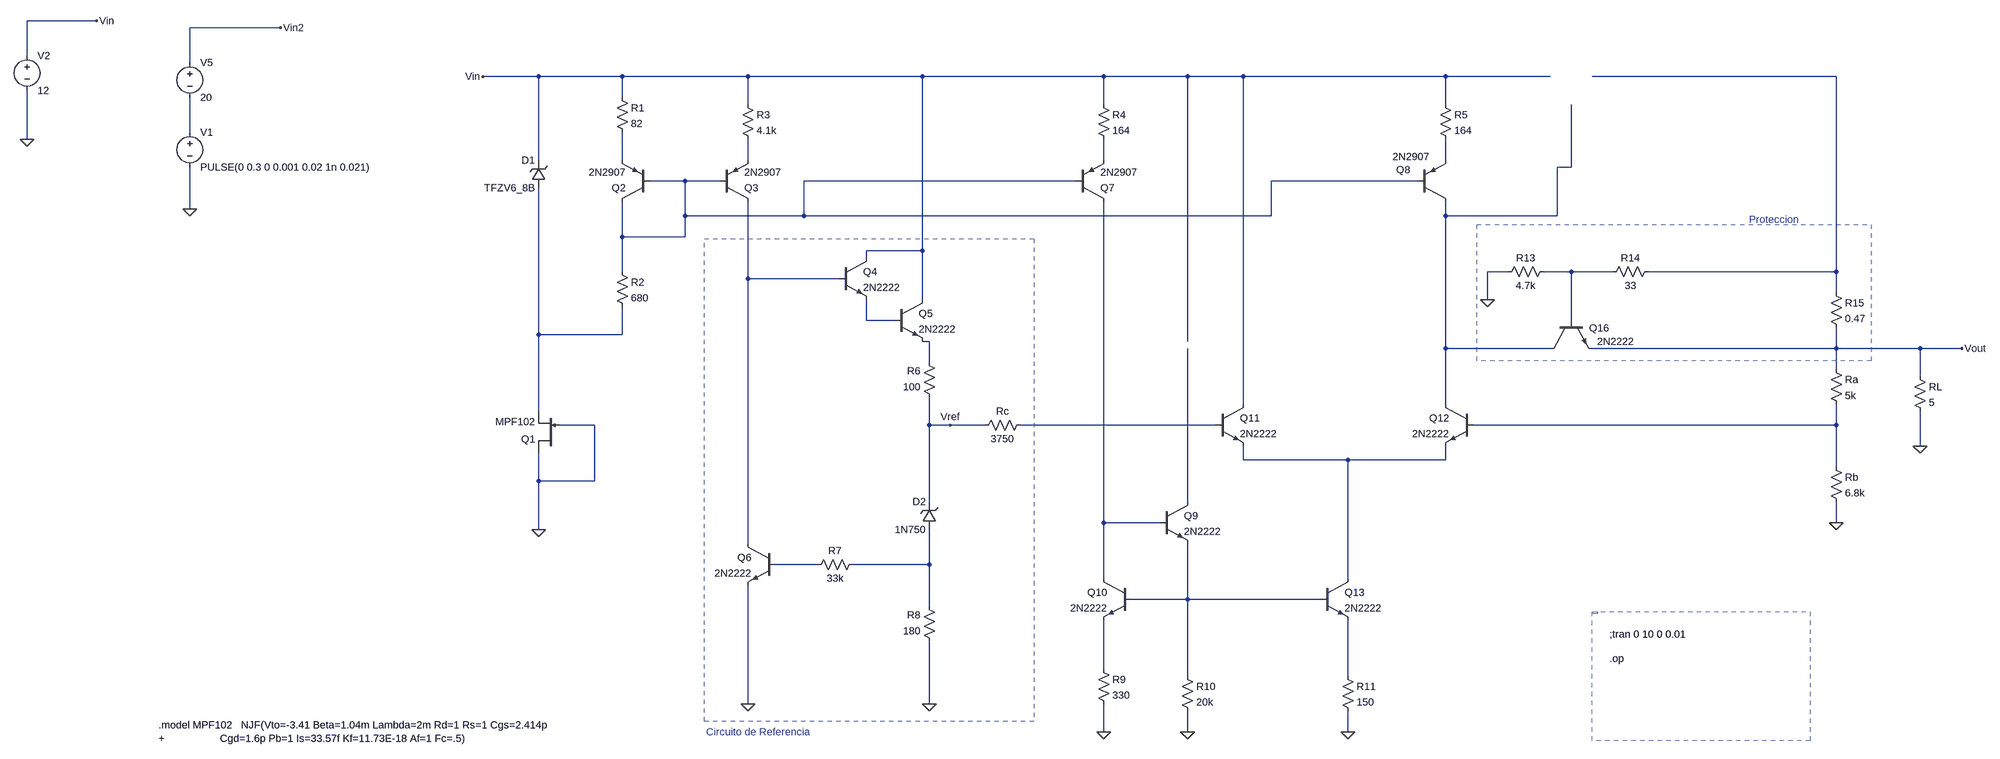
[diagram p0: schematic Test.asc]
Test.asc, the LTspice schematic file:
Version 4
SHEET 1 2264 1600
WIRE -3184 -240 -3392 -240
WIRE -2704 -224 -2912 -224
WIRE -3392 -160 -3392 -240
WIRE -2912 -144 -2912 -224
WIRE -2112 -112 -2240 -112
WIRE -1920 -112 -2112 -112
WIRE -1632 -112 -1920 -112
WIRE -1232 -112 -1632 -112
WIRE -816 -112 -1232 -112
WIRE -624 -112 -816 -112
WIRE -496 -112 -624 -112
WIRE -32 -112 -496 -112
WIRE 208 -112 -32 -112
WIRE 864 -112 304 -112
WIRE -1920 -64 -1920 -112
WIRE -1632 -48 -1632 -112
WIRE -816 -48 -816 -112
WIRE -32 -48 -32 -112
WIRE -2912 16 -2912 -64
WIRE -3392 32 -3392 -80
WIRE -2112 80 -2112 -112
WIRE -1920 80 -1920 16
WIRE -1632 80 -1632 32
WIRE -816 80 -816 32
WIRE -32 80 -32 32
WIRE 256 96 256 -48
WIRE 256 96 224 96
WIRE -1776 128 -1856 128
WIRE -1696 128 -1776 128
WIRE -880 128 -1504 128
WIRE -96 128 -432 128
WIRE -2912 192 -2912 96
WIRE -1776 208 -1776 128
WIRE -1504 208 -1504 128
WIRE -1504 208 -1776 208
WIRE -432 208 -432 128
WIRE -432 208 -1504 208
WIRE -32 208 -32 176
WIRE 224 208 224 96
WIRE 224 208 -32 208
WIRE -1920 256 -1920 176
WIRE -1776 256 -1776 208
WIRE -1776 256 -1920 256
WIRE -1232 288 -1232 -112
WIRE -1232 288 -1360 288
WIRE -1360 304 -1360 288
WIRE -1920 336 -1920 256
WIRE 112 336 64 336
WIRE 256 336 192 336
WIRE 352 336 256 336
WIRE 864 336 864 -112
WIRE 864 336 432 336
WIRE -1632 352 -1632 176
WIRE -1424 352 -1632 352
WIRE 864 384 864 336
WIRE -1232 400 -1232 288
WIRE 64 400 64 336
WIRE -1360 448 -1360 400
WIRE -1296 448 -1360 448
WIRE 256 448 256 336
WIRE -2112 480 -2112 144
WIRE -1920 480 -1920 416
WIRE -1920 480 -2112 480
WIRE -1216 496 -1232 496
WIRE -624 496 -624 -112
WIRE -32 512 -32 208
WIRE 208 512 -32 512
WIRE 864 512 864 464
WIRE 864 512 304 512
WIRE 1056 512 864 512
WIRE 1152 512 1056 512
WIRE -1216 544 -1216 496
WIRE 864 560 864 512
WIRE 1056 576 1056 512
WIRE -496 640 -496 -112
WIRE -32 640 -32 512
WIRE -2112 656 -2112 480
WIRE -1984 688 -2064 688
WIRE -1216 688 -1216 624
WIRE -1168 688 -1216 688
WIRE -1088 688 -1168 688
WIRE -560 688 -1008 688
WIRE 864 688 864 640
WIRE 864 688 32 688
WIRE 1056 736 1056 656
WIRE -496 768 -496 736
WIRE -256 768 -496 768
WIRE -32 768 -32 736
WIRE -32 768 -256 768
WIRE 864 784 864 688
WIRE -2112 816 -2112 752
WIRE -1984 816 -1984 688
WIRE -1984 816 -2112 816
WIRE -1216 864 -1216 688
WIRE -624 864 -624 512
WIRE -816 912 -816 176
WIRE -688 912 -816 912
WIRE 864 912 864 864
WIRE -2112 928 -2112 816
WIRE -1632 960 -1632 352
WIRE -1472 1008 -1568 1008
WIRE -1216 1008 -1216 928
WIRE -1216 1008 -1392 1008
WIRE -816 1040 -816 912
WIRE -256 1040 -256 768
WIRE -624 1088 -624 960
WIRE -624 1088 -752 1088
WIRE -320 1088 -624 1088
WIRE -1216 1104 -1216 1008
WIRE -816 1248 -816 1136
WIRE -624 1264 -624 1088
WIRE -256 1264 -256 1136
WIRE -1632 1328 -1632 1056
WIRE -1216 1328 -1216 1184
WIRE -816 1392 -816 1328
WIRE -624 1392 -624 1344
WIRE -256 1392 -256 1344
FLAG 1056 736 0
FLAG 864 912 0
FLAG 64 400 0
FLAG -2912 192 0
FLAG 1152 512 Vout
FLAG -1216 1328 0
FLAG -1632 1328 0
FLAG -2112 928 0
FLAG -816 1392 0
FLAG -256 1392 0
FLAG -624 1392 0
FLAG -2704 -224 Vin2
FLAG -2240 -112 Vin
FLAG -1168 688 Vref
FLAG -3184 -240 Vin
FLAG -3392 32 0
DATAFLAG 1056 512 "$"
DATAFLAG -1216 688 "$"
DATAFLAG -736 688 "$"
DATAFLAG -256 768 "$"
DATAFLAG 256 336 "$"
DATAFLAG 560 688 "$"
DATAFLAG 864 336 "$"
DATAFLAG -1776 128 "$"
DATAFLAG -2112 480 "$"
DATAFLAG -2112 -112 "$"
DATAFLAG -32 176 "Ic(Q8)"
DATAFLAG -1920 240 "Ic(Q2)"
DATAFLAG -816 192 "Ic(Q7)"
DATAFLAG -256 992 "Ic(Q13)"
DATAFLAG 416 -112 "Ix(U1:E)"
DATAFLAG 864 496 "I(R15)"
DATAFLAG 96 208 "Ix(U1:B)"
DATAFLAG 96 512 "Ic(Q16)"
DATAFLAG -32 560 "Ic(Q12)"
SYMBOL npn 208 448 M90
WINDOW 0 17 135 VLeft 2
WINDOW 3 48 192 VLeft 2
SYMATTR InstName Q16
SYMATTR Value 2N2222
SYMBOL npn 32 640 M0
SYMATTR InstName Q12
SYMATTR Value 2N2222
SYMBOL res 448 320 R90
WINDOW 0 0 56 VBottom 2
WINDOW 3 32 56 VTop 2
SYMATTR InstName R14
SYMATTR Value 33
SYMBOL res 208 320 R90
WINDOW 0 0 56 VBottom 2
WINDOW 3 32 56 VTop 2
SYMATTR InstName R13
SYMATTR Value 4.7k
SYMBOL res 848 368 R0
SYMATTR InstName R15
SYMATTR Value 0.47
SYMBOL res 848 544 R0
SYMATTR InstName Ra
SYMATTR Value 5k
SYMBOL res 1040 560 R0
SYMATTR InstName RL
SYMATTR Value 5
SYMBOL res 848 768 R0
SYMATTR InstName Rb
SYMATTR Value 6.8k
SYMBOL npn -560 640 R0
SYMATTR InstName Q11
SYMATTR Value 2N2222
SYMBOL zener -1200 928 R180
WINDOW 0 24 64 Left 2
WINDOW 3 24 0 Left 2
SYMATTR InstName D2
SYMATTR Value 1N750
SYMBOL res -1200 1200 R180
WINDOW 0 36 76 Left 2
WINDOW 3 36 40 Left 2
SYMATTR InstName R8
SYMATTR Value 180
SYMBOL res -1488 1024 R270
WINDOW 0 32 56 VTop 2
WINDOW 3 0 56 VBottom 2
SYMATTR InstName R7
SYMATTR Value 33k
SYMBOL npn -1568 960 M0
SYMATTR InstName Q6
SYMATTR Value 2N2222
SYMBOL npn -1424 304 R0
SYMATTR InstName Q4
SYMATTR Value 2N2222
SYMBOL npn -1296 400 R0
SYMATTR InstName Q5
SYMATTR Value 2N2222
SYMBOL res -1200 640 R180
WINDOW 0 36 76 Left 2
WINDOW 3 36 40 Left 2
SYMATTR InstName R6
SYMATTR Value 100
SYMBOL res -1104 704 R270
WINDOW 0 32 56 VTop 2
WINDOW 3 0 56 VBottom 2
SYMATTR InstName Rc
SYMATTR Value 3750
SYMBOL zener -2096 144 R180
WINDOW 0 24 64 Left 2
WINDOW 3 24 0 Left 2
SYMATTR InstName D1
SYMATTR Value TFZV6_8B
SYMBOL pnp -1856 176 R180
SYMATTR InstName Q2
SYMATTR Value 2N2907
SYMBOL pnp -1696 176 M180
SYMATTR InstName Q3
SYMATTR Value 2N2907
SYMBOL res -1936 -80 R0
SYMATTR InstName R1
SYMATTR Value 82
SYMBOL res -1648 -64 R0
SYMATTR InstName R3
SYMATTR Value 4.1k
SYMBOL res -1936 320 R0
SYMATTR InstName R2
SYMATTR Value 680
SYMBOL njf -2064 752 R180
SYMATTR InstName Q1
SYMATTR Value MPF102
SYMBOL pnp -96 176 M180
WINDOW 0 -49 74 Left 2
WINDOW 3 -58 104 Left 2
SYMATTR InstName Q8
SYMATTR Value 2N2907
SYMBOL res -48 -64 R0
SYMATTR InstName R5
SYMATTR Value 164
SYMBOL pnp -880 176 M180
SYMATTR InstName Q7
SYMATTR Value 2N2907
SYMBOL res -832 -64 R0
SYMATTR InstName R4
SYMATTR Value 164
SYMBOL npn -752 1040 M0
SYMATTR InstName Q10
SYMATTR Value 2N2222
SYMBOL npn -320 1040 R0
SYMATTR InstName Q13
SYMATTR Value 2N2222
SYMBOL res -832 1232 R0
SYMATTR InstName R9
SYMATTR Value 330
SYMBOL res -272 1248 R0
SYMATTR InstName R11
SYMATTR Value 150
SYMBOL npn -688 864 R0
SYMATTR InstName Q9
SYMATTR Value 2N2222
SYMBOL res -640 1248 R0
SYMATTR InstName R10
SYMATTR Value 20k
SYMBOL voltage -2912 -160 R0
SYMATTR InstName V5
SYMATTR Value 20
SYMBOL voltage -2912 0 R0
SYMATTR InstName V1
SYMATTR Value PULSE(0 0.3 0 0.001 0.02 1n 0.021)
SYMBOL voltage -3392 -176 R0
WINDOW 123 0 0 Left 0
WINDOW 39 0 0 Left 0
SYMATTR InstName V2
SYMATTR Value 12
TEXT 344 1168 Left 2 !;tran 0 10 0 0.01
TEXT 344 1224 Left 2 !.op
TEXT -1728 1392 Left 2 ;Circuito de Referencia
TEXT 664 216 Left 2 ;Proteccion
TEXT -2984 1376 Left 2 !.model MPF102   NJF(Vto=-3.41 Beta=1.04m Lambda=2m Rd=1 Rs=1 Cgs=2.414p\n+                   Cgd=1.6p Pb=1 Is=33.57f Kf=11.73E-18 Af=1 Fc=.5)
RECTANGLE Normal 316 1120 304 1116 2
RECTANGLE Normal 804 1412 304 1116 1
RECTANGLE Normal -1732 260 -976 1368 2
RECTANGLE Normal 40 228 944 540 2

The netlist it stands for:
* Test.asc
Q16 N007 N009 Vout 0 2N2222
Q12 N007 N015 N016 0 2N2222
R14 N001 N009 33
R13 N009 0 4.7k
R15 N001 Vout 0.47
Ra Vout N015 5k
RL Vout 0 5
Rb N015 0 6.8k
Q11 Vin N014 N016 0 2N2222
D2 N020 Vref 1N750
R8 0 N020 180
R7 N019 N020 33k
Q6 N010 N019 0 0 2N2222
Q4 Vin N010 N011 0 2N2222
Q5 Vin N011 N013 0 2N2222
R6 Vref N013 100
Rc Vref N014 3750
D1 N012 Vin TFZV6_8B
Q2 N008 N008 N003 0 2N2907
Q3 N010 N008 N004 0 2N2907
R1 Vin N003 82
R3 Vin N004 4.1k
R2 N008 N012 680
J§Q1 0 0 N012 MPF102
Q8 N007 N008 N006 0 2N2907
R5 Vin N006 164
Q7 N018 N008 N005 0 2N2907
R4 Vin N005 164
Q10 N018 N021 N022 0 2N2222
Q13 N016 N021 N023 0 2N2222
R9 N022 0 330
R11 N023 0 150
Q9 N017 N018 N021 0 2N2222
R10 N021 0 20k
V5 Vin2 N002 20
V1 N002 0 PULSE(0 0.3 0 0.001 0.02 1n 0.021)
V2 Vin 0 12
.model D D
.lib standard.dio
.model NPN NPN
.model PNP PNP
.lib standard.bjt
.model NJF NJF
.model PJF PJF
.lib standard.jft
;tran 0 10 0 0.01
.op
* Circuito de Referencia
* Proteccion
.model MPF102   NJF(Vto=-3.41 Beta=1.04m Lambda=2m Rd=1 Rs=1 Cgs=2.414p
+                   Cgd=1.6p Pb=1 Is=33.57f Kf=11.73E-18 Af=1 Fc=.5)
.backanno
.end